# EAGLE design TuringBack (EAGLE 7.4.0)
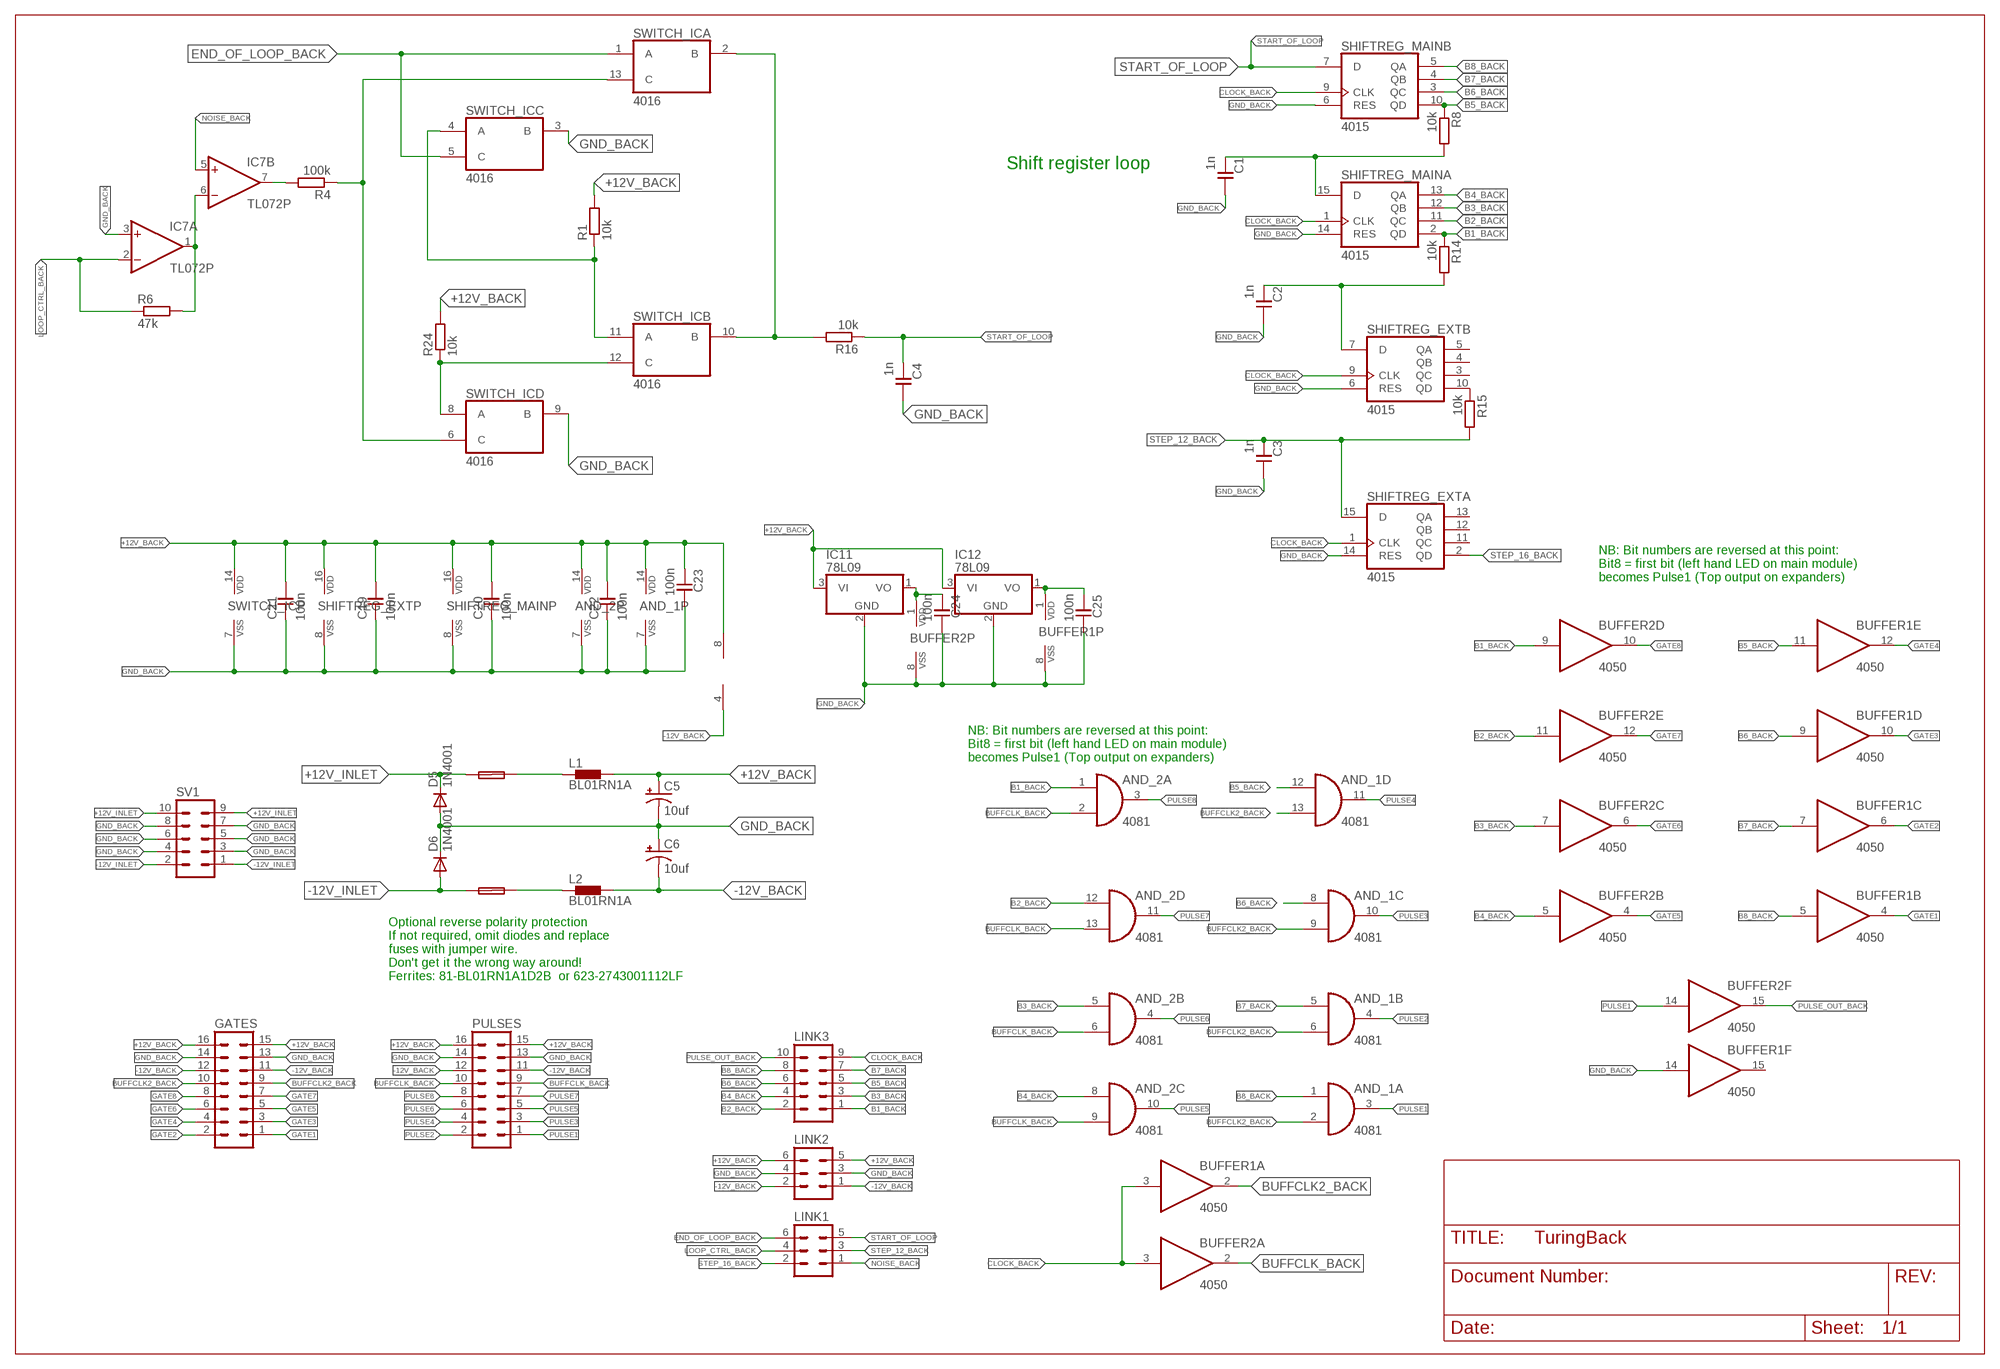
[diagram p0: schematic, sheet 1]

## Parts
+FUSE  +FUSE  PTC_FUSEPOLY_FUSE  [C050H075X075]
-FUSE  -FUSE  PTC_FUSEPOLY_FUSE  [C050H075X075]
AND_1  4081  4081N  [DIL14]
AND_2  4081  4081N  [DIL14]
BUFFER1  4050  4050N  [DIL16]
BUFFER2  4050  4050N  [DIL16]
C1  1n  C-EU050-024X044  [C050-024X044]
C2  1n  C-EU050-024X044  [C050-024X044]
C3  1n  C-EU050-024X044  [C050-024X044]
C4  1n  C-EU050-024X044  [C050-024X044]
C5  10uf  CAP_POLPTH2  [CPOL-RADIAL-10UF-25V]
C6  10uf  CAP_POLPTH2  [CPOL-RADIAL-10UF-25V]
C19  100n  C-EU050-024X044  [C050-024X044]
C20  100n  C-EU050-024X044  [C050-024X044]
C21  100n  C-EU050-024X044  [C050-024X044]
C22  100n  C-EU050-024X044  [C050-024X044]
C23  100n  C-EU050-024X044  [C050-024X044]
C24  100n  C-EU050-024X044  [C050-024X044]
C25  100n  C-EU050-024X044  [C050-024X044]
D5  1N4001  1N4004  [DO41-10]
D6  1N4001  1N4004  [DO41-10]
GATES  MA08-2  [MA08-2]
IC7  TL072P  [DIL08]
IC11  78L09  7808L  [TO92]
IC12  78L09  7808L  [TO92]
L1  BL01RN1A  [BL01RN1A]
L2  BL01RN1A  [BL01RN1A]
LINK1  MA03-2  [MA03-2]
LINK2  MA03-2  [MA03-2]
LINK3  MA05-2  [MA05-2]
PULSES  MA08-2  [MA08-2]
R1  10k  R-EU_0207/7  [0207/7]
R4  100k  R-EU_0207/7  [0207/7]
R6  47k  R-EU_0207/7  [0207/7]
R8  10k  R-EU_0207/7  [0207/7]
R14  10k  R-EU_0207/7  [0207/7]
R15  10k  R-EU_0207/7  [0207/7]
R16  10k  R-EU_0207/7  [0207/7]
R24  10k  R-EU_0207/7  [0207/7]
SHIFTREG_EXT  4015  4015N  [DIL16]
SHIFTREG_MAIN  4015  4015N  [DIL16]
SV1  10_PIN_HEADER  [MA05-2]
SWITCH_IC  4016  4016N  [DIL14]

## Nets
+9V_1 [power]: BUFFER2.1(P:VDD) C24.2 IC11.1(VO)
+9V_2 [power]: BUFFER1.1(P:VDD) C25.2 IC12.1(VO)
+12V_BACK [power]: AND_1.14(P:VDD) AND_2.14(P:VDD) C5.1(+) C19.1 C20.1 C21.1 C22.1 C23.2 GATES.15 GATES.16 IC7.8(P:V+) IC11.3(VI) IC12.3(VI) L1.2 LINK2.5 LINK2.6 PULSES.15 PULSES.16 R1.2 R24.2 SHIFTREG_EXT.16(P:VDD) SHIFTREG_MAIN.16(P:VDD) SWITCH_IC.14(P:VDD)
+12V_INLET [power]: +FUSE.1 D5.C SV1.9 SV1.10
-12V_BACK [power]: C6.2(-) GATES.11 GATES.12 IC7.4(P:V-) L2.2 LINK2.1 LINK2.2 PULSES.11 PULSES.12
-12V_INLET [power]: -FUSE.1 D6.A SV1.1 SV1.2
B1_BACK: AND_2.1(A:I0) BUFFER2.9(D:I) LINK3.1 R14.1 SHIFTREG_MAIN.2(A:QD)
B2_BACK: AND_2.12(D:I0) BUFFER2.11(E:I) LINK3.2 SHIFTREG_MAIN.11(A:QC)
B3_BACK: AND_2.5(B:I0) BUFFER2.7(C:I) LINK3.3 SHIFTREG_MAIN.12(A:QB)
B4_BACK: AND_2.8(C:I0) BUFFER2.5(B:I) LINK3.4 SHIFTREG_MAIN.13(A:QA)
B5_BACK: AND_1.12(D:I0) BUFFER1.11(E:I) LINK3.5 R8.1 SHIFTREG_MAIN.10(B:QD)
B6_BACK: AND_1.8(C:I0) BUFFER1.9(D:I) LINK3.6 SHIFTREG_MAIN.3(B:QC)
B7_BACK: AND_1.5(B:I0) BUFFER1.7(C:I) LINK3.7 SHIFTREG_MAIN.4(B:QB)
B8_BACK: AND_1.1(A:I0) BUFFER1.5(B:I) LINK3.8 SHIFTREG_MAIN.5(B:QA)
BUFFCLK2_BACK: AND_1.2(A:I1) AND_1.6(B:I1) AND_1.9(C:I1) AND_1.13(D:I1) BUFFER1.2(A:O) GATES.9 GATES.10
BUFFCLK_BACK: AND_2.2(A:I1) AND_2.6(B:I1) AND_2.9(C:I1) AND_2.13(D:I1) BUFFER2.2(A:O) PULSES.9 PULSES.10
CLOCK_BACK: BUFFER1.3(A:I) BUFFER2.3(A:I) LINK3.9 SHIFTREG_EXT.1(A:CLK) SHIFTREG_EXT.9(B:CLK) SHIFTREG_MAIN.1(A:CLK) SHIFTREG_MAIN.9(B:CLK)
END_OF_LOOP_BACK: LINK1.6 SWITCH_IC.1(A:A) SWITCH_IC.5(C:C)
GATE1: BUFFER1.4(B:O) GATES.1
GATE2: BUFFER1.6(C:O) GATES.2
GATE3: BUFFER1.10(D:O) GATES.3
GATE4: BUFFER1.12(E:O) GATES.4
GATE5: BUFFER2.4(B:O) GATES.5
GATE6: BUFFER2.6(C:O) GATES.6
GATE7: BUFFER2.12(E:O) GATES.7
GATE8: BUFFER2.10(D:O) GATES.8
GND_BACK [ground]: AND_1.7(P:VSS) AND_2.7(P:VSS) BUFFER1.8(P:VSS) BUFFER1.14(F:I) BUFFER2.8(P:VSS) C1.1 C2.1 C3.1 C4.1 C5.2(-) C6.1(+) C19.2 C20.2 C21.2 C22.2 C23.1 C24.1 C25.1 D5.A D6.C GATES.13 GATES.14 IC7.3(A:+IN) IC11.2(GND) IC12.2(GND) LINK2.3 LINK2.4 PULSES.13 PULSES.14 SHIFTREG_EXT.6(B:RES) SHIFTREG_EXT.8(P:VSS) SHIFTREG_EXT.14(A:RES) SHIFTREG_MAIN.6(B:RES) SHIFTREG_MAIN.8(P:VSS) SHIFTREG_MAIN.14(A:RES) SV1.3 SV1.4 SV1.5 SV1.6 SV1.7 SV1.8 SWITCH_IC.3(C:B) SWITCH_IC.7(P:VSS) SWITCH_IC.9(D:B)
LOOP_CTRL_BACK: IC7.2(A:-IN) LINK1.4 R6.1
N$1: IC7.7(B:OUT) R4.2
N$2: R4.1 SWITCH_IC.6(D:C) SWITCH_IC.13(A:C)
N$4: R1.1 SWITCH_IC.4(C:A) SWITCH_IC.11(B:A)
N$7: IC7.1(A:OUT) IC7.6(B:-IN) R6.2
N$10: C1.2 R8.2 SHIFTREG_MAIN.15(A:D)
N$14: R15.1 SHIFTREG_EXT.10(B:QD)
N$17: R16.2 SWITCH_IC.2(A:B) SWITCH_IC.10(B:B)
N$28: C2.2 R14.2 SHIFTREG_EXT.7(B:D)
N$42 [power]: +FUSE.2 L1.1
N$44 [power]: -FUSE.2 L2.1
N$45: R24.1 SWITCH_IC.8(D:A) SWITCH_IC.12(B:C)
NOISE_BACK: IC7.5(B:+IN) LINK1.1
PULSE1: AND_1.3(A:O) BUFFER2.14(F:I) PULSES.1
PULSE2: AND_1.4(B:O) PULSES.2
PULSE3: AND_1.10(C:O) PULSES.3
PULSE4: AND_1.11(D:O) PULSES.4
PULSE5: AND_2.10(C:O) PULSES.5
PULSE6: AND_2.4(B:O) PULSES.6
PULSE7: AND_2.11(D:O) PULSES.7
PULSE8: AND_2.3(A:O) PULSES.8
PULSE_OUT_BACK: BUFFER2.15(F:O) LINK3.10
START_OF_LOOP: C4.2 LINK1.5 R16.1 SHIFTREG_MAIN.7(B:D)
STEP_12_BACK: C3.2 LINK1.3 R15.2 SHIFTREG_EXT.15(A:D)
STEP_16_BACK: LINK1.2 SHIFTREG_EXT.2(A:QD)
Unconnected: BUFFER1.15(F:O) SHIFTREG_EXT.3(B:QC) SHIFTREG_EXT.4(B:QB) SHIFTREG_EXT.5(B:QA) SHIFTREG_EXT.11(A:QC) SHIFTREG_EXT.12(A:QB) SHIFTREG_EXT.13(A:QA)

## Notes on the sheet
- Shift register loop
- NB: Bit numbers are reversed at this point: 
  Bit8 = first bit (left hand LED on main module) 
  becomes Pulse1 (Top output on expanders)
- NB: Bit numbers are reversed at this point: 
  Bit8 = first bit (left hand LED on main module) 
  becomes Pulse1 (Top output on expanders)
- Optional reverse polarity protection
  If not required, omit diodes and replace
  fuses with jumper wire. 
  Don't get it the wrong way around! 
  Ferrites: 81-BL01RN1A1D2B  or 623-2743001112LF

## Library data of the parts
+FUSE -FUSE = TomW:PTC_FUSE
AND_1 AND_2 = 40xx:4081: Quad 2-input AND
BUFFER1 BUFFER2 = 40xx:4050: Hex non-inverting BUFFER
C1-C4 C19-C25 = TomW:C-EU: CAPACITOR, European symbol
C5 C6 = SparkFun-Passives:CAP_POL: Capacitor Polarized These are standard SMD and PTH capacitors. Normally 10uF, 47uF, and 100uF in electrolytic and tantalum varieties. Always verify the external diameter of the through hole cap, it varies with capacity, voltage, and manufacturer. The EIA devices should be standard.
D5 D6 = diode:1N4004: DIODE general purpose rectifier, 1 A
GATES PULSES = con-lstb:MA08-2: PIN HEADER; OC_FARNELL: unknown; OC_NEWARK: unknown
IC7 = TomW:TL072: OP AMP
IC11 IC12 = linear:78*: Positive VOLTAGE REGULATOR Source: http://cache.national.com/ds/LM/LM78L05.pdf http://www.fairchildsemi.com/ds/LM/LM7805.pdf
L1 L2 = inductors:BL0: Noise Suppression Products/EMI Suppression Filters, Lead EMIFIL(R) Inductor Type Source: http://www.murata.com .. BL01RN1_DS.pdf
LINK1 LINK2 = con-lstb:MA03-2: PIN HEADER; OC_FARNELL: unknown; OC_NEWARK: unknown
LINK3 = con-lstb:MA05-2: PIN HEADER; OC_FARNELL: unknown; OC_NEWARK: unknown
R1 R4 R6 R8 R14-R16 R24 = TomW:R-EU_: RESISTOR, European symbol
SHIFTREG_EXT SHIFTREG_MAIN = 40xx:4015: Dual 4-bit static SHIFT REGISTER
SV1 = TomW:10_PIN_HEADER: PIN HEADER; OC_FARNELL: unknown; OC_NEWARK: unknown
SWITCH_IC = 40xx:4016: Quad bilateral ANALOG SWITCH

## Net classes
0 default: width 0.254 mm
1 power: width 0.406 mm
2 ground: width 0.406 mm

## Board
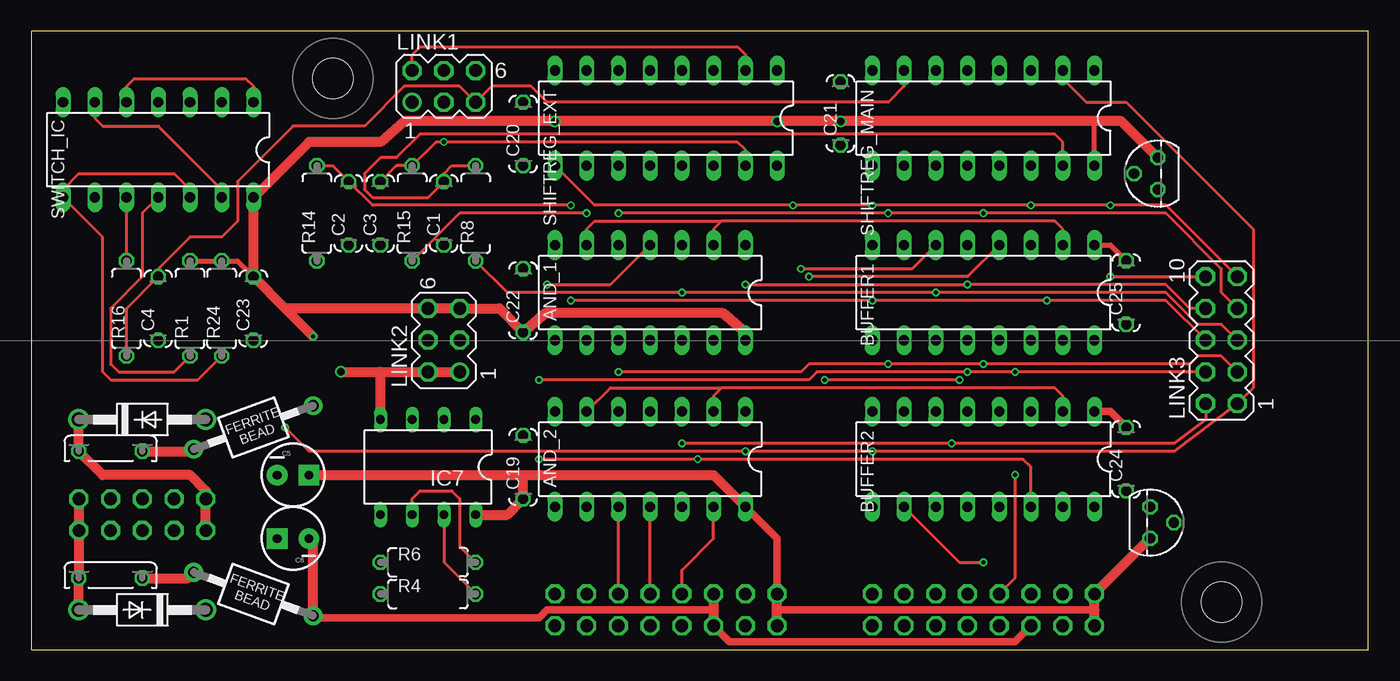
[diagram p1: board, top side]
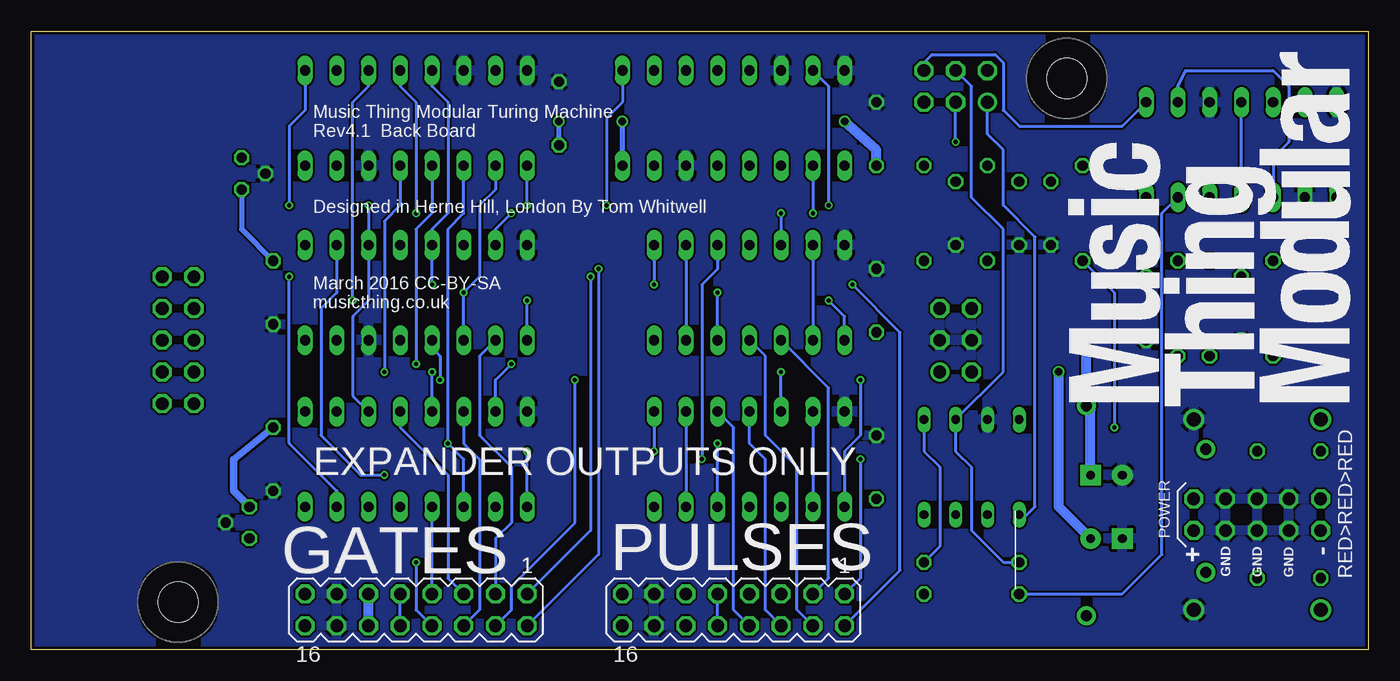
[diagram p2: board, bottom side, seen from below]

Size 107 x 49.5 mm. Coordinates in mm from the lower left corner, seen from the top.
Outline: 0,49.5 0,0 107,0 107,49.5 0,49.5
Copper layers (1*2*15*16): Top 0.035mm / dielectric 0.2mm / Route2 0.0175mm / dielectric 1.1mm / Route15 0.0175mm / dielectric 0.2mm / Bottom 0.035mm
Design rules "SeeedStudio_DRU_no_angle_20130527": minimum track width 6mil, minimum drill 12mil, track to track 6mil, track to pad 6mil, pad to pad 6mil, via to via 6mil, smd to smd 0mil, copper to edge 10mil, drill to drill 10mil, minimum pad ring 6mil, minimum via ring 6mil, stop-mask expansion 2mil, vias tented up to drill 25mil, thermal gap 10mil

### Footprints (pad centres in the part's own frame; a part is rotated, then mirrored left to right if it is on the bottom)
C050H075X075 = drill 0.813 octagon: 1 -2.54,0; 2 2.54,0
DIL14 = drill 0.813 long: 1 -7.62,-3.81; 2 -5.08,-3.81; 3 -2.54,-3.81; 4 0,-3.81; 5 2.54,-3.81; 6 5.08,-3.81; 7 7.62,-3.81; 8 7.62,3.81; 9 5.08,3.81; 10 2.54,3.81; 11 0,3.81; 12 -2.54,3.81; 13 -5.08,3.81; 14 -7.62,3.81
DIL16 = drill 0.813 long: 1 -8.89,-3.81; 2 -6.35,-3.81; 3 -3.81,-3.81; 4 -1.27,-3.81; 5 1.27,-3.81; 6 3.81,-3.81; 7 6.35,-3.81; 8 8.89,-3.81; 9 8.89,3.81; 10 6.35,3.81; 11 3.81,3.81; 12 1.27,3.81; 13 -1.27,3.81; 14 -3.81,3.81; 15 -6.35,3.81; 16 -8.89,3.81
C050-024X044 = drill 0.813 octagon: 1 -2.54,0; 2 2.54,0
CPOL-RADIAL-10UF-25V = drill 0.7 pad 1.651 square: 1 1.27,0 | drill 0.7 pad 1.651: 2 -1.27,0
DO41-10 = drill 1.118: A 5.08,0; C -5.08,0
MA08-2 = drill 1.016 octagon: 1 -8.89,-1.27; 2 -8.89,1.27; 3 -6.35,-1.27; 4 -6.35,1.27; 5 -3.81,-1.27; 6 -3.81,1.27; 7 -1.27,-1.27; 8 -1.27,1.27; 9 1.27,-1.27; 10 1.27,1.27; 11 3.81,-1.27; 12 3.81,1.27; 13 6.35,-1.27; 14 6.35,1.27; 15 8.89,-1.27; 16 8.89,1.27
DIL08 = drill 0.7 long: 1 -3.81,-3.81; 2 -1.27,-3.81; 3 1.27,-3.81; 4 3.81,-3.81; 5 3.81,3.81; 6 1.27,3.81; 7 -1.27,3.81; 8 -3.81,3.81
TO92 = drill 0.813 octagon: 1 -1.27,0; 2 0,1.905; 3 1.27,0
BL01RN1A = drill 0.9 pad 1.5: 1 -5.08,0; 2 5.08,0
MA03-2 = drill 1.016: 1 -2.54,-1.27 | drill 1.016 octagon: 2 -2.54,1.27; 3 0,-1.27; 4 0,1.27; 5 2.54,-1.27; 6 2.54,1.27
MA05-2 = drill 1.016 octagon: 1 -5.08,-1.27; 2 -5.08,1.27; 3 -2.54,-1.27; 4 -2.54,1.27; 5 0,-1.27; 6 0,1.27; 7 2.54,-1.27; 8 2.54,1.27; 9 5.08,-1.27; 10 5.08,1.27
0207/7 = drill 0.813 octagon: 1 -3.81,0; 2 3.81,0
MOUNTING_HOLE = hole 3.2: 0,0

### Placement (x,y rotation side)
+FUSE  6.35,15.88 0 top
-FUSE  6.35,5.71 0 top
AND_1  49.53,28.57 180 top
AND_2  49.53,15.24 180 top
BUFFER1  76.2,28.57 180 top
BUFFER2  76.2,15.24 180 top
C1  33.02,34.92 90 top
C2  25.4,34.92 90 top
C3  27.94,34.92 90 top
C4  10.16,27.3 90 top
C5  20.95,13.97 0 top
C6  20.95,8.89 180 top
C19  39.37,14.61 90 top
C20  39.37,41.27 90 top
C21  64.77,42.93 90 top
C22  39.37,27.94 90 top
C23  17.78,27.3 90 top
C24  87.63,15.24 90 top
C25  87.63,28.57 90 top
D5  8.89,18.41 0 top
D6  8.89,3.17 180 top
GATES  76.2,3.17 180 bottom
IC7  31.75,14.61 180 top
IC11  89.53,10.16 270 top
IC12  90.17,38.1 90 top
L1  17.78,17.78 20 top
L2  17.78,4.45 340 top
LINK1  33.02,45.09 0 top
LINK2  33.02,24.77 90 top
LINK3  95.25,24.77 90 top
PULSES  50.8,3.17 180 bottom
R1  12.7,27.3 90 top
R4  31.75,4.45 0 top
R6  31.75,6.99 0 top
R8  35.56,34.92 90 top
R14  22.86,34.92 90 top
R15  30.48,34.92 90 top
R16  7.62,27.3 90 top
R24  15.24,27.3 90 top
SHIFTREG_EXT  50.8,42.55 180 top
SHIFTREG_MAIN  76.2,42.55 180 top
SV1  8.89,10.79 180 bottom
SWITCH_IC  10.16,40.01 180 top
U$4  [MOUNTING_HOLE]  24.13,45.72 0 top
U$5  [MOUNTING_HOLE]  95.25,3.81 0 top

### Tracks (layer width: path | path; a pad name or v marks a point on that pad's centre or on a via)
+9V_1
  Top 0.61: BUFFER2.1 86.36,19.05 C24.2
  Bottom 0.61: C24.2 90.81,15.24 90.81,12.7 IC11.1
+9V_2
  Top 0.406: BUFFER1.1 86.36,32.38 C25.2
  Bottom 0.406: IC12.1 90.17,33.66 C25.2
+12V_BACK  (via drill 0.33, 0.6)
  Top 0.406: SHIFTREG_MAIN.16 85.09,42.29 | R1.2 R24.2 16.51,31.11 C23.2
  Top 0.61: PULSES.15 59.69,8.89 AND_2.14 | 59.69,3.17 85.09,3.17
  Top 0.813: IC12.3 87.25,42.29 85.09,42.29 v64.77,42.29 v59.69,42.29 v41.91,42.29 29.84,42.29 27.94,40.64 22.23,40.64 SWITCH_IC.14 C23.2 20.32,27.3 | 20.32,27.3 LINK2.6 LINK2.5 37.47,27.3 C22.1 41.15,26.92 55.37,26.92 57.15,25.4 AND_1.14 | C5.1 39.37,13.97 | 39.37,13.97 54.61,13.97 AND_2.14 | IC7.8 38.1,10.79 C19.1 39.37,13.97 | GATES.16 85.09,3.17 GATES.15 IC11.3 | PULSES.16 59.69,3.17 PULSES.15 | v22.55,25.07 20.32,27.3
  Bottom 0.406: SHIFTREG_EXT.16 v59.69,42.29 | C21.1 v64.77,42.29
  Bottom 0.813: C5.1 22.23,19.19 L1.2 v22.55,25.07 | C20.1 39.37,40.01 v41.91,42.29
+12V_INLET
  Top 0.813: SV1.10 SV1.9 13.97,12.7 12.7,13.97 5.71,13.97 +FUSE.1 D5.C
-12V_BACK  (via drill 0.61)
  Top 0.61: L2.2 22.72,2.54 40.64,2.54 41.27,3.17 54.61,3.17 | PULSES.12 55.88,0.64 78.74,0.64 GATES.12
  Top 0.813: L2.2 22.55,8.56 C6.2 | PULSES.11 54.61,3.17 PULSES.12 | v24.77,22.23 27.94,22.23 | 27.94,22.23 LINK2.2 LINK2.1 | IC7.4 27.94,22.23
  Bottom 0.813: GATES.12 GATES.11 | C6.2 24.77,11.43 v24.77,22.23
-12V_INLET
  Top 0.813: SV1.1 SV1.2 -FUSE.1 D6.A
B1_BACK  (via drill 0.33)
  Top 0.254: v20.32,17.78 22.23,15.88 v57.15,15.88 v67.31,15.88 91.44,15.88 LINK3.1 97.79,20.95 97.79,33.66 87.63,43.81 84.45,43.81 82.55,45.72 SHIFTREG_MAIN.2
  Bottom 0.254: R14.1 20.32,28.57 v20.32,17.78 | AND_2.1 v57.15,15.88 | BUFFER2.9 v67.31,15.88
B2_BACK  (via drill 0.33)
  Top 0.254: LINK3.2 93.98,18.41 91.44,16.51 v73.66,16.51 v52.07,16.51
  Bottom 0.254: AND_2.12 v52.07,16.51 | BUFFER2.11 72.39,15.24 v73.66,16.51 73.66,33.66 72.39,34.92 SHIFTREG_MAIN.11
B3_BACK  (via drill 0.33)
  Top 0.254: LINK3.3 95.25,23.5 93.34,23.5 92.71,22.86 v76.2,22.86 v68.58,22.86 62.23,22.86 61.59,22.23 v46.99,22.23
  Bottom 0.254: AND_2.5 v46.99,22.23 | BUFFER2.7 69.85,21.59 v68.58,22.86 | SHIFTREG_MAIN.12 74.93,34.92 76.2,33.66 v76.2,22.86
B4_BACK  (via drill 0.33)
  Top 0.254: LINK3.4 v78.74,22.23 v74.93,22.23 62.87,22.23 62.23,21.59 v40.64,21.59
  Bottom 0.254: v40.64,21.59 40.64,17.14 41.91,15.88 AND_2.8 | SHIFTREG_MAIN.13 77.47,35.56 78.74,34.29 v78.74,22.23 | BUFFER2.5 v74.93,22.23
B5_BACK  (via drill 0.33)
  Top 0.254: LINK3.5 95.25,26.04 93.34,26.04 90.81,28.57 v72.39,28.57 v52.07,28.57 38.1,28.57 R8.1
  Bottom 0.254: SHIFTREG_MAIN.10 69.85,36.83 71.12,35.56 71.12,29.84 v72.39,28.57 BUFFER1.11 | AND_1.12 v52.07,28.57
B6_BACK  (via drill 0.33)
  Top 0.254: LINK3.6 90.81,27.94 v81.28,27.94 v67.31,27.94 v43.18,27.94
  Bottom 0.254: AND_1.8 41.91,26.67 v43.18,27.94 | BUFFER1.9 v67.31,27.94 | v81.28,27.94 81.28,43.81 80.01,45.09 SHIFTREG_MAIN.3
B7_BACK  (via drill 0.33)
  Top 0.254: LINK3.7 95.25,28.57 95.25,30.48 90.81,34.92 v76.2,34.92 v68.58,34.92 v46.99,34.92
  Bottom 0.254: v46.99,34.92 AND_1.5 | BUFFER1.7 69.85,33.66 v68.58,34.92 | SHIFTREG_MAIN.4 77.47,45.09 76.2,43.81 v76.2,34.92
B8_BACK  (via drill 0.33)
  Top 0.254: LINK3.8 92.71,27.3 90.81,29.21 v74.93,29.21 v57.15,29.21
  Bottom 0.254: v74.93,29.21 BUFFER1.5 74.93,33.66 73.66,34.92 73.66,43.81 74.93,45.09 SHIFTREG_MAIN.5 | AND_1.1 v57.15,29.21
BUFFCLK2_BACK  (via drill 0.33)
  Top 0.254: BUFFER1.2 82.55,33.66 81.92,34.29 55.24,34.29 | 55.24,34.29 54.61,33.66 AND_1.2 | AND_1.6 44.45,33.66 45.09,34.29 55.24,34.29 | v78.74,13.97 78.74,5.71 GATES.9
  Bottom 0.254: GATES.10 GATES.9 | AND_1.6 AND_1.9 | AND_1.2 AND_1.13 | BUFFER1.2 82.55,28.57 83.82,27.3 83.82,17.14 80.64,13.97 v78.74,13.97
BUFFCLK_BACK
  Top 0.254: BUFFER2.2 82.55,20.32 81.92,20.95 55.24,20.95 | 55.24,20.95 54.61,20.32 AND_2.2 | AND_2.6 46.35,20.95 55.24,20.95 | PULSES.9 52.07,6.35 54.61,8.89 AND_2.13
  Bottom 0.254: AND_2.6 AND_2.9 | AND_2.2 AND_2.13 | PULSES.10 PULSES.9
CLOCK_BACK  (via drill 0.33)
  Top 0.254: LINK3.9 90.81,35.56 v86.36,35.56 v80.01,35.56 v67.31,35.56 v60.96,35.56 45.09,35.56 SHIFTREG_EXT.9
  Bottom 0.254: SHIFTREG_MAIN.1 85.09,43.18 86.36,41.91 v86.36,35.56 | v80.01,35.56 BUFFER1.3 80.01,27.94 81.28,26.67 81.28,20.32 BUFFER2.3 | v67.31,35.56 SHIFTREG_MAIN.9 | SHIFTREG_EXT.1 59.69,43.81 60.96,42.55 v60.96,35.56
END_OF_LOOP_BACK
  Top 0.254: SWITCH_IC.5 7.62,45.09 8.26,45.72 17.14,45.72 17.78,45.09 SWITCH_IC.1
  Bottom 0.254: LINK1.6 35.56,46.99 34.92,47.62 29.84,47.62 29.21,46.99 29.21,43.18 27.94,41.91 19.68,41.91 SWITCH_IC.1
GATE1  (via drill 0.33)
  Top 0.254: BUFFER1.4 74.93,29.84 v62.23,29.84
  Bottom 0.254: v62.23,29.84 62.23,9.53 GATES.1
GATE2  (via drill 0.33)
  Top 0.254: BUFFER1.6 70.48,30.48 v61.59,30.48
  Bottom 0.254: v61.59,30.48 61.59,7.62 GATES.2
GATE3
  Bottom 0.254: BUFFER1.10 71.12,23.5 71.12,17.14 68.58,14.61 68.58,10.16 69.85,8.89 GATES.3
GATE4  (via drill 0.33)
  Top 0.254: v74.3,21.59 v63.5,21.59
  Bottom 0.254: BUFFER1.12 74.93,24.13 74.3,23.5 v74.3,21.59 | GATES.4 68.58,3.17 68.58,5.08 63.5,10.16 v63.5,21.59
GATE5
  Bottom 0.254: BUFFER2.4 77.47,17.78 73.66,13.97 73.66,5.71 GATES.5
GATE6
  Bottom 0.254: BUFFER2.6 72.39,16.51 71.12,15.24 71.12,3.17 GATES.6
GATE7
  Bottom 0.254: GATES.7 BUFFER2.12
GATE8  (via drill 0.33)
  Top 0.254: BUFFER2.10 74.3,6.99 v76.2,6.99
  Bottom 0.254: v76.2,6.99 76.2,3.17 GATES.8
GND_BACK
  pour Bottom: -1.91,50.8 109.86,50.8 109.86,-1.27 -1.91,-1.27
LOOP_CTRL_BACK
  Bottom 0.254: R6.1 29.21,6.99 31.75,9.53 31.75,14.61 33.02,15.88 IC7.2 29.21,22.23 29.21,33.66 31.75,36.2 31.75,45.09 LINK1.4
N$1
  Top 0.254: IC7.7 33.02,6.99 R4.2
N$2
  Top 0.254: SWITCH_IC.6 5.08,42.55 5.71,41.91 10.16,41.91 15.24,36.83 SWITCH_IC.13
  Bottom 0.254: SWITCH_IC.13 16.51,34.92 16.51,7.62 19.68,4.45 R4.1
N$4
  Top 0.254: SWITCH_IC.11 8.89,34.92 8.89,29.84 6.35,27.3 6.35,22.86 6.99,22.23 11.43,22.23 R1.1
  Bottom 0.254: SWITCH_IC.11 SWITCH_IC.4
N$7
  Top 0.254: IC7.6 30.48,12.06 31.11,12.7 33.66,12.7 34.29,12.06 34.29,8.26 R6.2
  Bottom 0.254: IC7.1 35.56,15.88 34.29,14.61 34.29,8.26 R6.2
N$10
  Top 0.254: SHIFTREG_MAIN.15 82.55,40.64 81.92,41.27 31.11,41.27 29.21,39.37 27.94,39.37 26.67,38.1 26.67,36.83 27.3,36.2 31.75,36.2 C1.2 33.02,38.1 33.66,38.73 R8.2
N$14  (via drill 0.33)
  Top 0.254: v44.45,34.92 34.29,34.92 R15.1
  Bottom 0.254: SHIFTREG_EXT.10 v44.45,34.92
N$17
  Top 0.254: R16.2 SWITCH_IC.10
  Bottom 0.254: SWITCH_IC.2 15.24,45.09 14.61,46.35 7.62,46.35 6.35,45.09 6.35,40.64 7.62,39.37 SWITCH_IC.10
N$28  (via drill 0.33)
  Top 0.254: v43.18,35.56 27.3,35.56 C2.2 24.13,38.73 R14.2
  Bottom 0.254: SHIFTREG_EXT.7 43.18,45.09 v43.18,35.56
N$42
  Top 0.813: +FUSE.2 12.84,15.88 L1.1
N$44
  Top 0.813: -FUSE.2 12.54,5.71 L2.1
N$45
  Top 0.254: R24.1 13.34,21.59 6.35,21.59 5.71,22.23 5.71,33.02 SWITCH_IC.8 2.54,36.83 3.81,38.1 11.43,38.1 12.7,36.83 SWITCH_IC.12
NOISE_BACK
  Bottom 0.254: IC7.5 27.3,10.79 26.67,11.43 26.67,33.02 29.21,35.56 29.21,40.01 30.48,41.27 LINK1.1
PULSE1  (via drill 0.33)
  Top 0.254: BUFFER2.14 80.01,14.61 79.38,15.24 v53.34,15.24 v40.64,15.24
  Bottom 0.254: v40.64,15.24 40.64,5.71 PULSES.1 | AND_1.3 52.07,30.48 53.34,29.21 v53.34,15.24
PULSE2  (via drill 0.33)
  Top 0.254: v41.27,29.21 46.35,29.21 AND_1.4
  Bottom 0.254: PULSES.2 37.47,6.35 37.47,25.4 v41.27,29.21
PULSE3
  Bottom 0.254: PULSES.3 43.18,5.71 43.18,20.95 AND_1.10
PULSE4
  Bottom 0.254: PULSES.4 45.72,3.17 45.72,14.61 48.26,17.14 48.26,23.5 AND_1.11
PULSE5
  Top 0.254: PULSES.5 AND_2.10
PULSE6
  Bottom 0.254: PULSES.6 48.26,3.17 48.26,15.24 49.53,16.51 AND_2.4
PULSE7
  Top 0.254: PULSES.7 AND_2.11
PULSE8
  Bottom 0.254: PULSES.8 50.8,3.17 50.8,17.78 AND_2.3
PULSE_OUT_BACK  (via drill 0.33)
  Top 0.254: v86.36,29.84 LINK3.10
  Bottom 0.254: BUFFER2.15 82.55,12.7 86.36,16.51 v86.36,29.84
START_OF_LOOP
  Top 0.254: SHIFTREG_MAIN.7 69.85,45.09 68.58,43.81 41.27,43.81 40.01,45.09 36.83,45.09 LINK1.5 34.29,45.09 29.84,45.09 26.67,41.91 20.95,41.91 16.51,37.47 16.51,34.29 15.24,33.02 12.7,33.02 10.16,30.48 C4.2 7.62,27.3 R16.1
STEP_12_BACK  (via drill 0.33)
  Top 0.254: SHIFTREG_EXT.15 57.15,40.01 56.52,40.64 v33.02,40.64 32.38,40.64 R15.2 29.21,38.73 C3.2
  Bottom 0.254: v33.02,40.64 LINK1.3
STEP_16_BACK
  Top 0.254: LINK1.2 30.48,47.62 31.11,48.26 56.52,48.26 57.15,47.62 SHIFTREG_EXT.2

### Text on the board
tPlace: FERRITE / BEAD | FERRITE / BEAD
bPlace: Music Thing Modular Turing Machine / Rev4.1 Back Board / / / / Designed in Herne Hill, London By Tom Whitwell / / / / March 2016 CC-BY-SA / musicthing.co.uk | EXPANDER OUTPUTS ONLY
bStop: Terry / Riley | Lunetta | Cage | Stanley | John | Steve Reich | Philip Glass | Nicholas Collins | Fredkin & Minsky | Ken Stone | Grant Richter | Don Buchla | Allen Strange | Hal Chamberlin | Dieter Doepfer | K.F.W | Navs | Tony / Steventon | The Muff Wigglers | Steven Grimley-Taylor | Inspired by: